# Altium schematic sheet OPAMP_TESTER_3.SchDoc
size A4; SheetNumber: 4; SheetTotal: 4
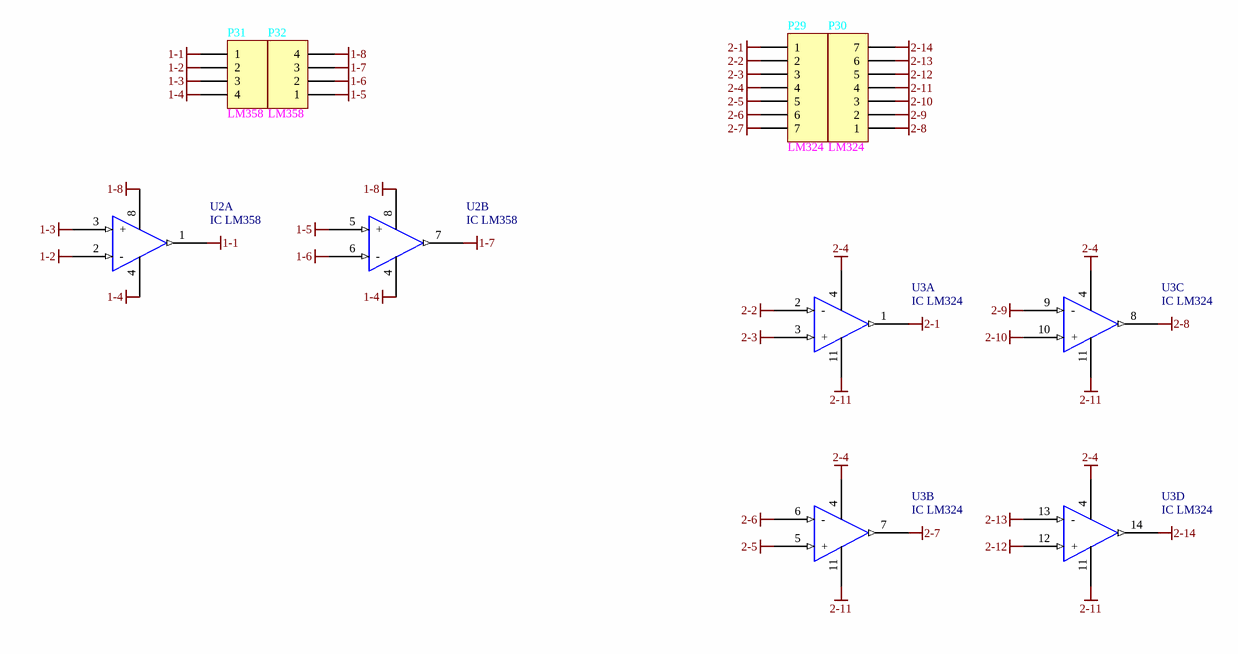
[diagram p0: OPAMP_TESTER_3.SchDoc]

## Parts
P29  LM324  [CON HDR 2.54FM 7]
P30  LM324  [CON HDR 2.54FM 7]
P31  LM358  [CON HDR 2.54FM 4]
P32  LM358  [CON HDR 2.54FM 4]
U2  IC LM358  [SMD IC SOP8]  (parts A,B of 2)
U3  IC LM324  [SMD IC SOP14]  (parts A,B,C,D of 4)

## Nets
1-1: P31.1 U2.1(OUT1)
1-2: P31.2 U2.2(-)
1-3: P31.3 U2.3(+)
1-4: P31.4 U2.4(GND)
1-5: P32.1 U2.5(+)
1-6: P32.2 U2.6(-)
1-7: P32.3 U2.7(OUT1)
1-8: P32.4 U2.8(VCC)
2-1: P29.1 U3.1(OUT1)
2-2: P29.2 U3.2(-)
2-3: P29.3 U3.3(+)
2-4: P29.4 U3.4(VCC)
2-5: P29.5 U3.5(+)
2-6: P29.6 U3.6(-)
2-7: P29.7 U3.7(OUT1)
2-8: P30.1 U3.8(OUT1)
2-9: P30.2 U3.9(-)
2-10: P30.3 U3.10(+)
2-11: P30.4 U3.11(GND)
2-12: P30.5 U3.12(+)
2-13: P30.6 U3.13(-)
2-14: P30.7 U3.14(OUT1)

## Notes on the sheet
- DrawnBy:
- ProjectName:
- Date:
- CheckedBy:
- Size:
- A4
- File:
- Sheet
- of

## Library data of the parts
P29 P30 = CONNECTOR 7: Header, 7-Pin; LatestRevisionDate: 17-Jul-2002; LatestRevisionNote: Re-released for DXP Platform.; Publisher: Altium Limited
P31 P32 = CONNECTOR 4: Header, 4-Pin; LatestRevisionDate: 17-Jul-2002; LatestRevisionNote: Re-released for DXP Platform.; Publisher: Altium Limited